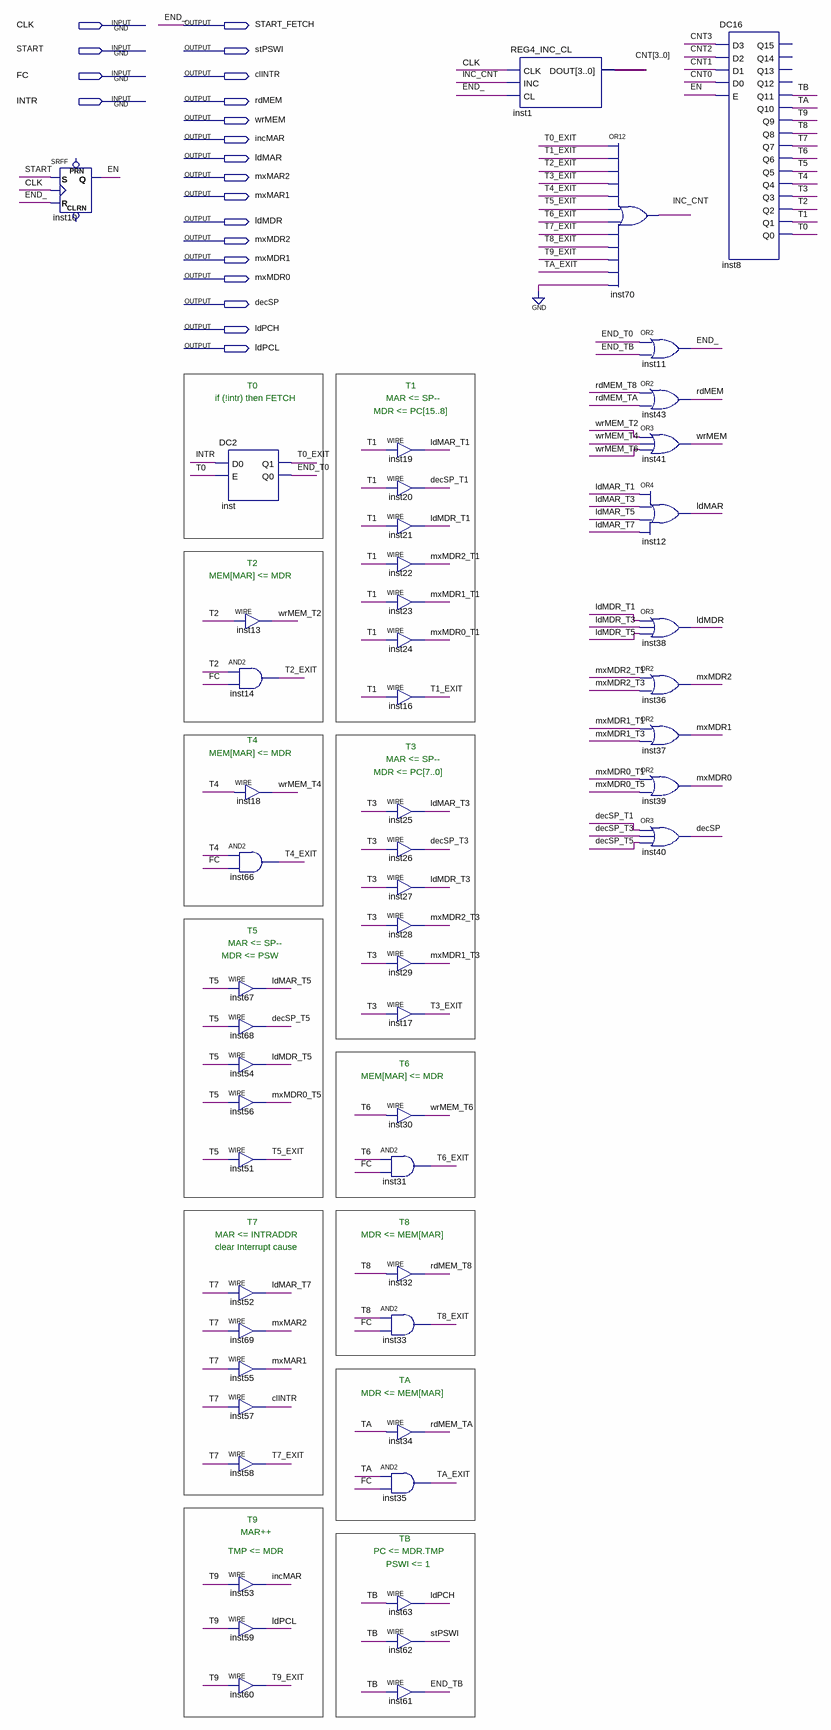
[diagram p0: schematic sheet]
// Quartus schematic cpu_intr.bdf as structural Verilog: 53 symbols, 20 pins
module cpu_intr (
  input  CLK,
  input  START,
  input  FC,
  input  INTR,
  output START_FETCH,
  output stPSWI,
  output clINTR,
  output rdMEM,
  output wrMEM,
  output incMAR,
  output ldMAR,
  output mxMAR2,
  output mxMAR1,
  output ldMDR,
  output mxMDR2,
  output mxMDR1,
  output mxMDR0,
  output decSP,
  output ldPCH,
  output ldPCL
);

  wire decSP_T1, decSP_T3, decSP_T5, EN, END_T0, END_TB, INC_CNT, ldMAR_T1, ldMAR_T3, ldMAR_T5, ldMAR_T7,
       ldMDR_T1, ldMDR_T3, ldMDR_T5, mxMDR0_T1, mxMDR0_T5, mxMDR1_T1, mxMDR1_T3, mxMDR2_T1, mxMDR2_T3,
       rdMEM_T8, rdMEM_TA, T0, T0_EXIT, T1, T1_EXIT, T2, T2_EXIT, T3, T3_EXIT, T4, T4_EXIT, T5, T5_EXIT, T6,
       T6_EXIT, T7, T7_EXIT, T8, T8_EXIT, T9, T9_EXIT, TA, TA_EXIT, TB, wrMEM_T2, wrMEM_T4, wrMEM_T6;
  wire [3:0] CNT;

  SRFF inst10 (.S(START), .R(START_FETCH), .CLK(CLK), .Q(EN));  // open: PRN, CLRN
  DC2 inst (.D0(INTR), .E(T0), .Q1(T0_EXIT), .Q0(END_T0));
  assign wrMEM_T2 = T2;  // WIRE inst13
  and inst14 (T2_EXIT, T2, FC);
  assign wrMEM_T4 = T4;  // WIRE inst18
  and inst66 (T4_EXIT, T4, FC);
  assign ldMAR_T5 = T5;  // WIRE inst67
  assign decSP_T5 = T5;  // WIRE inst68
  assign ldMDR_T5 = T5;  // WIRE inst54
  assign mxMDR0_T5 = T5;  // WIRE inst56
  assign T5_EXIT = T5;  // WIRE inst51
  assign ldMAR_T7 = T7;  // WIRE inst52
  assign mxMAR2 = T7;  // WIRE inst69
  assign mxMAR1 = T7;  // WIRE inst55
  assign clINTR = T7;  // WIRE inst57
  assign T7_EXIT = T7;  // WIRE inst58
  assign incMAR = T9;  // WIRE inst53
  assign ldPCL = T9;  // WIRE inst59
  assign T9_EXIT = T9;  // WIRE inst60
  assign ldMAR_T1 = T1;  // WIRE inst19
  assign decSP_T1 = T1;  // WIRE inst20
  assign ldMDR_T1 = T1;  // WIRE inst21
  assign mxMDR2_T1 = T1;  // WIRE inst22
  assign mxMDR1_T1 = T1;  // WIRE inst23
  assign mxMDR0_T1 = T1;  // WIRE inst24
  assign T1_EXIT = T1;  // WIRE inst16
  assign ldMAR_T3 = T3;  // WIRE inst25
  assign decSP_T3 = T3;  // WIRE inst26
  assign ldMDR_T3 = T3;  // WIRE inst27
  assign mxMDR2_T3 = T3;  // WIRE inst28
  assign mxMDR1_T3 = T3;  // WIRE inst29
  assign T3_EXIT = T3;  // WIRE inst17
  assign wrMEM_T6 = T6;  // WIRE inst30
  and inst31 (T6_EXIT, T6, FC);
  assign rdMEM_T8 = T8;  // WIRE inst32
  and inst33 (T8_EXIT, T8, FC);
  assign rdMEM_TA = TA;  // WIRE inst34
  and inst35 (TA_EXIT, TA, FC);
  assign ldPCH = TB;  // WIRE inst63
  assign stPSWI = TB;  // WIRE inst62
  assign END_TB = TB;  // WIRE inst61
  REG4_INC_CL inst1 (.CLK(CLK), .INC(INC_CNT), .CL(START_FETCH), .DOUT(CNT));
  or inst70 (INC_CNT, T0_EXIT, T1_EXIT, T2_EXIT, T3_EXIT, T4_EXIT, T5_EXIT, T6_EXIT, T7_EXIT, T8_EXIT, T9_EXIT, TA_EXIT, 1'b0);
  or inst11 (START_FETCH, END_T0, END_TB);
  or inst43 (rdMEM, rdMEM_T8, rdMEM_TA);
  or inst41 (wrMEM, wrMEM_T2, wrMEM_T4, wrMEM_T6);
  or inst12 (ldMAR, ldMAR_T1, ldMAR_T3, ldMAR_T5, ldMAR_T7);
  or inst38 (ldMDR, ldMDR_T1, ldMDR_T3, ldMDR_T5);
  or inst36 (mxMDR2, mxMDR2_T1, mxMDR2_T3);
  or inst37 (mxMDR1, mxMDR1_T1, mxMDR1_T3);
  or inst39 (mxMDR0, mxMDR0_T1, mxMDR0_T5);
  or inst40 (decSP, decSP_T1, decSP_T3, decSP_T5);
  DC16 inst8 (
    .D3(CNT[3]), .D2(CNT[2]), .D1(CNT[1]), .D0(CNT[0]), .E(EN), .Q11(TB), .Q10(TA), .Q9(T9), .Q8(T8),
    .Q7(T7), .Q6(T6), .Q5(T5), .Q4(T4), .Q3(T3), .Q2(T2), .Q1(T1), .Q0(T0));  // open: Q15, Q14, Q13, Q12

  // Other names for the same wires on the sheet: END_ = START_FETCH

  // Notes on the sheet:
  //   T0
  //   T1
  //   if (!intr) then FETCH
  //   MAR <= SP--
  //   MDR <= PC[15..8]
  //   T2
  //   MEM[MAR] <= MDR 
  //   T4
  //   T3
  //   MEM[MAR] <= MDR 
  //   MAR <= SP--
  //   MDR <= PC[7..0]
  //   T5
  //   MAR <= SP--
  //   MDR <= PSW
  //   T6
  //   MEM[MAR] <= MDR 
  //   T7
  //   T8
  //   MAR <= INTRADDR
  //   MDR <= MEM[MAR] 
  //   clear Interrupt cause
  //   TA
  //   MDR <= MEM[MAR] 
  //   T9
  //   MAR++
  //   TB
  //   TMP <= MDR
  //   PC <= MDR.TMP
  //   PSWI <= 1 
endmodule
